# EAGLE design photo (EAGLE 6.5.0)
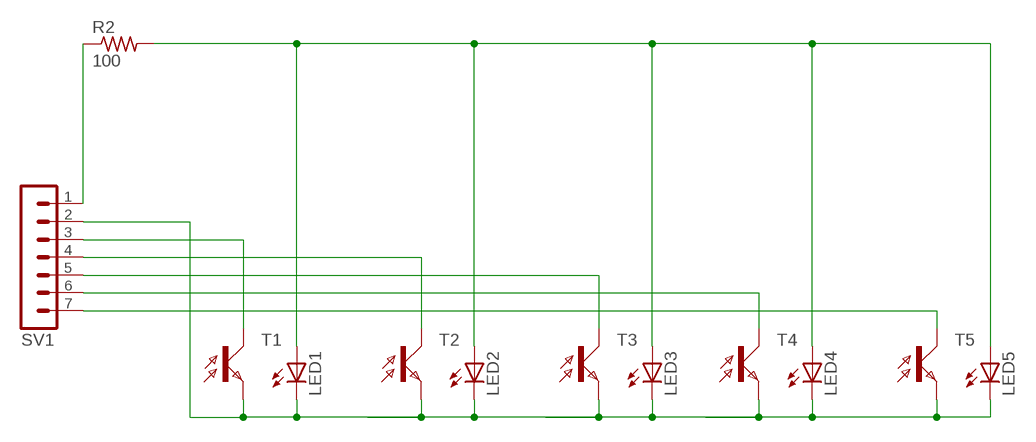
[diagram p0: schematic, sheet 1]

## Parts
LED1  LED3MM  [LED3MM]
LED2  LED3MM  [LED3MM]
LED3  LED3MM  [LED3MM]
LED4  LED3MM  [LED3MM]
LED5  LED3MM  [LED3MM]
R2  100  R-US_0204/7  [0204/7]
SV1  MA07-1  [MA07-1]
T1  LPT80A  [LPT80A]
T2  LPT80A  [LPT80A]
T3  LPT80A  [LPT80A]
T4  LPT80A  [LPT80A]
T5  LPT80A  [LPT80A]

## Nets
N$2: LED1.A LED2.A LED3.A LED4.A LED5.A R2.2
N$3: SV1.4 T2.C
N$4: R2.1 SV1.1
N$8: SV1.3 T1.C
N$10: SV1.5 T3.C
N$15: SV1.6 T4.C
N$17: LED1.K(C) LED2.K(C) LED3.K(C) LED4.K(C) LED5.K(C) SV1.2 T1.E T2.E T3.E T4.E T5.E
N$19: SV1.7 T5.C

## Library data of the parts
LED1-LED5 = adafruit:LED: LED OSRAM: - CHIPLED LG R971, LG N971, LY N971, LG Q971, LY Q971, LO R971, LY R971 LH N974, LH R974 LS Q976, LO Q976, LY Q976 LO Q996 - Hyper CHIPLED LW Q18S LB Q993, LB Q99A, LB R99A - SideLED LS A670, LO A670, LY A670, LG A670, LP A670 LB A673, LV A673, LT A673, LW A673 LH A674 LY A675 LS A676, LA A676, LO A676, LY A676, LW A676 LS A679, LY A679, LG A679 - Hyper Micro SIDELED® LS Y876, LA Y876, LO Y876, LY Y876 LT Y87S - SmartLED LW L88C, LW L88S LB L89C, LB L89S, LG L890 LS L89K, LO L89K, LY L89K LS L896, LA L896, LO L896, LY L896 - TOPLED LS T670, LO T670, LY T670, LG T670, LP T670 LSG T670, LSP T670, LSY T670, LOP T670, LYG T670 LG T671, LOG T671, LSG T671 LB T673, LV T673, LT T673, LW T673 LH T674 LS T676, LA T676, LO T676, LY T676, LB T676, LH T676, LSB T676, LW T676 LB T67C, LV T67C, LT T67C, LS T67K, LO T67K, LY T67K, LW E67C LS E67B, LA E67B, LO E67B, LY E67B, LB E67C, LV E67C, LT E67C LW T67C LS T679, LY T679, LG T679 LS T770, LO T770, LY T770, LG T770, LP T770 LB T773, LV T773, LT T773, LW T773 LH T774 LS E675, LA E675, LY E675, LS T675 LS T776, LA T776, LO T776, LY T776, LB T776 LHGB T686 LT T68C, LB T68C - Hyper Mini TOPLED® LB M676 - Mini TOPLED Santana® LG M470 LS M47K, LO M47K, LY M47K Source: http://www.osram.convergy.de/
R2 = adafruit:R-US_: RESISTOR, American symbol
SV1 = con-lstb:MA07-1: PIN HEADER; OC_FARNELL: unknown; OC_NEWARK: unknown
T1-T5 = opto-trans-siemens:LPT80A: PHOTO TRANSISTOR; OC_FARNELL: unknown; OC_NEWARK: unknown

## Board
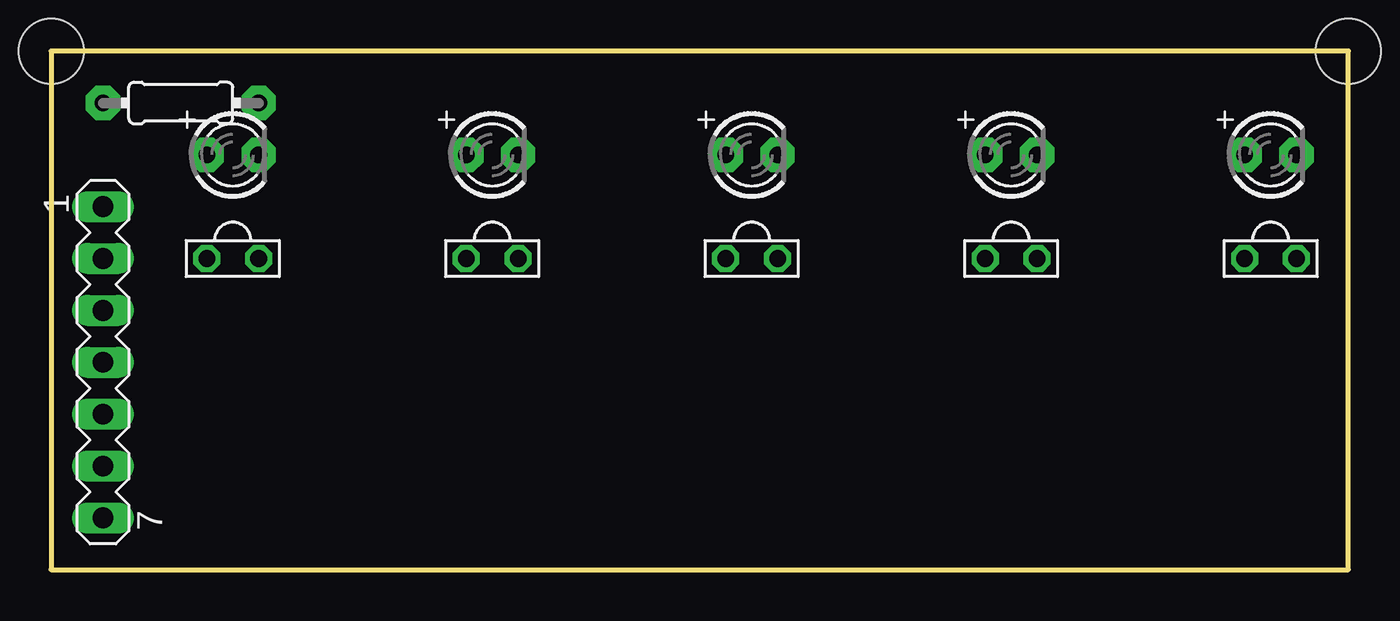
[diagram p1: board, top side]
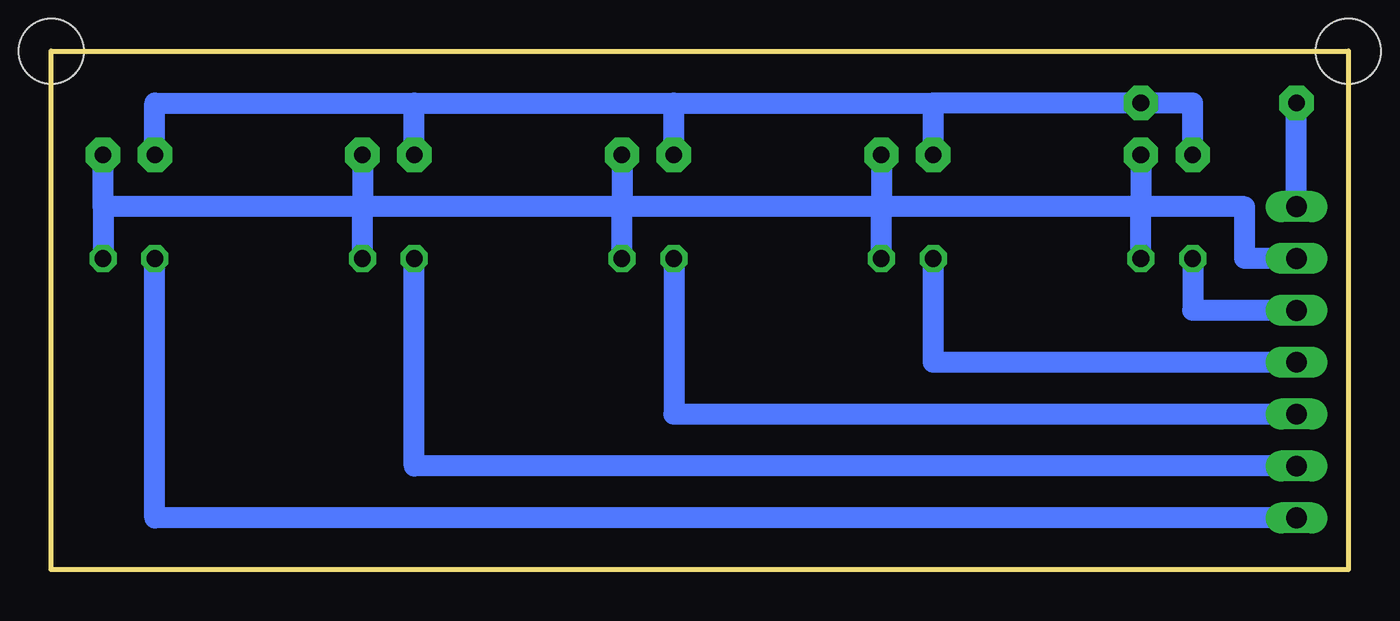
[diagram p2: board, bottom side, seen from below]

Size 63.5 x 25.4 mm. Coordinates in mm from the lower left corner, seen from the top.
Outline: 0,0 63.5,0 63.5,25.4 0,25.4 0,0
Copper layers (1*16): Top 0.035mm / dielectric 1.5mm / Bottom 0.035mm
Design rules "default": minimum track width 10mil, minimum drill 24mil, track to track 8mil, track to pad 8mil, pad to pad 8mil, via to via 8mil, smd to smd 8mil, copper to edge 40mil, drill to drill 8mil, minimum pad ring 10mil, minimum via ring 8mil, stop-mask expansion 4mil, vias tented up to drill 0mil, thermal gap 10mil
Holes 3.17 mm at 63.5,25.4 0,25.4

### Footprints (pad centres in the part's own frame; a part is rotated, then mirrored left to right if it is on the bottom)
LED3MM = drill 0.813 pad 1.676 octagon: A -1.27,0; K 1.27,0
0204/7 = drill 0.813 pad 1.676 octagon: 1 -3.81,0; 2 3.81,0
MA07-1 = drill 1.016 long: 1 -7.62,0; 2 -5.08,0; 3 -2.54,0; 4 0,0; 5 2.54,0; 6 5.08,0; 7 7.62,0
LPT80A = drill 0.813 octagon: C 0,-1.27; E 0,1.27

### Placement (x,y rotation side)
LED1  8.89,20.32 0 top
LED2  21.59,20.32 0 top
LED3  34.29,20.32 0 top
LED4  46.99,20.32 0 top
LED5  59.69,20.32 0 top
R2  6.35,22.86 0 top
SV1  2.54,10.16 270 top
T1  8.89,15.24 270 top
T2  21.59,15.24 270 top
T3  34.29,15.24 270 top
T4  46.99,15.24 270 top
T5  59.69,15.24 270 top

### Tracks (layer width: path | path; a pad name or v marks a point on that pad's centre or on a via)
N$2
  Bottom 1.016: 45.72,22.86 58.42,22.86 LED5.A | 45.72,22.86 33.02,22.86 | 33.02,22.86 20.32,22.86 | LED2.A 20.32,22.86 | LED3.A 33.02,22.86 | LED4.A 45.72,22.86 | LED1.A 7.62,22.86 20.32,22.86
N$3
  Bottom 1.016: SV1.4 20.32,10.16 T2.C
N$4
  Bottom 1.016: SV1.1 R2.1
N$8
  Bottom 1.016: SV1.3 7.62,12.7 T1.C
N$10
  Bottom 1.016: T3.C 33.02,7.62 SV1.5
N$15
  Bottom 1.016: SV1.6 45.72,5.08 T4.C
N$17
  Bottom 1.016: SV1.2 5.08,15.24 5.08,17.78 10.16,17.78 | 10.16,17.78 22.86,17.78 | 22.86,17.78 35.56,17.78 | 35.56,17.78 48.26,17.78 | 48.26,17.78 60.96,17.78 | 60.96,17.78 LED5.K | 60.96,17.78 T5.E | T4.E 48.26,17.78 | LED4.K 48.26,17.78 | LED3.K 35.56,17.78 | T3.E 35.56,17.78 | T2.E 22.86,17.78 | LED2.K 22.86,17.78 | LED1.K 10.16,17.78 | T1.E 10.16,17.78
N$19
  Bottom 1.016: SV1.7 58.42,2.54 T5.C